# Altium schematic sheet Sensors.SchDoc: RespiraWorks
size A3; CompanyName: RespiraWorks; DrawnBy: E. Chiu; Organization: Altium; DocumentNumber: 7; Revision: A1; SheetNumber: 7; SheetTotal: 8; PageSetup: Record=PageOptions|CenterHorizontal=True|CenterVertical=True|PrintScale=0.67|XCorrection=1.00|YCorrection=1.00|PrintKind=0|BorderSize=5000000|LeftOffset=0|BottomOffset=0|Orientation=2|PaperLength=1000|PaperWidth=1000|Scale=100|PaperSource=276|PrintQuality=-3|MediaType=1|DitherType=10|PrintScaleMode=1|PaperKind=11"x17" 279.4x431.8mm|PaperIndex=3; ProjectName: FALCON 3S
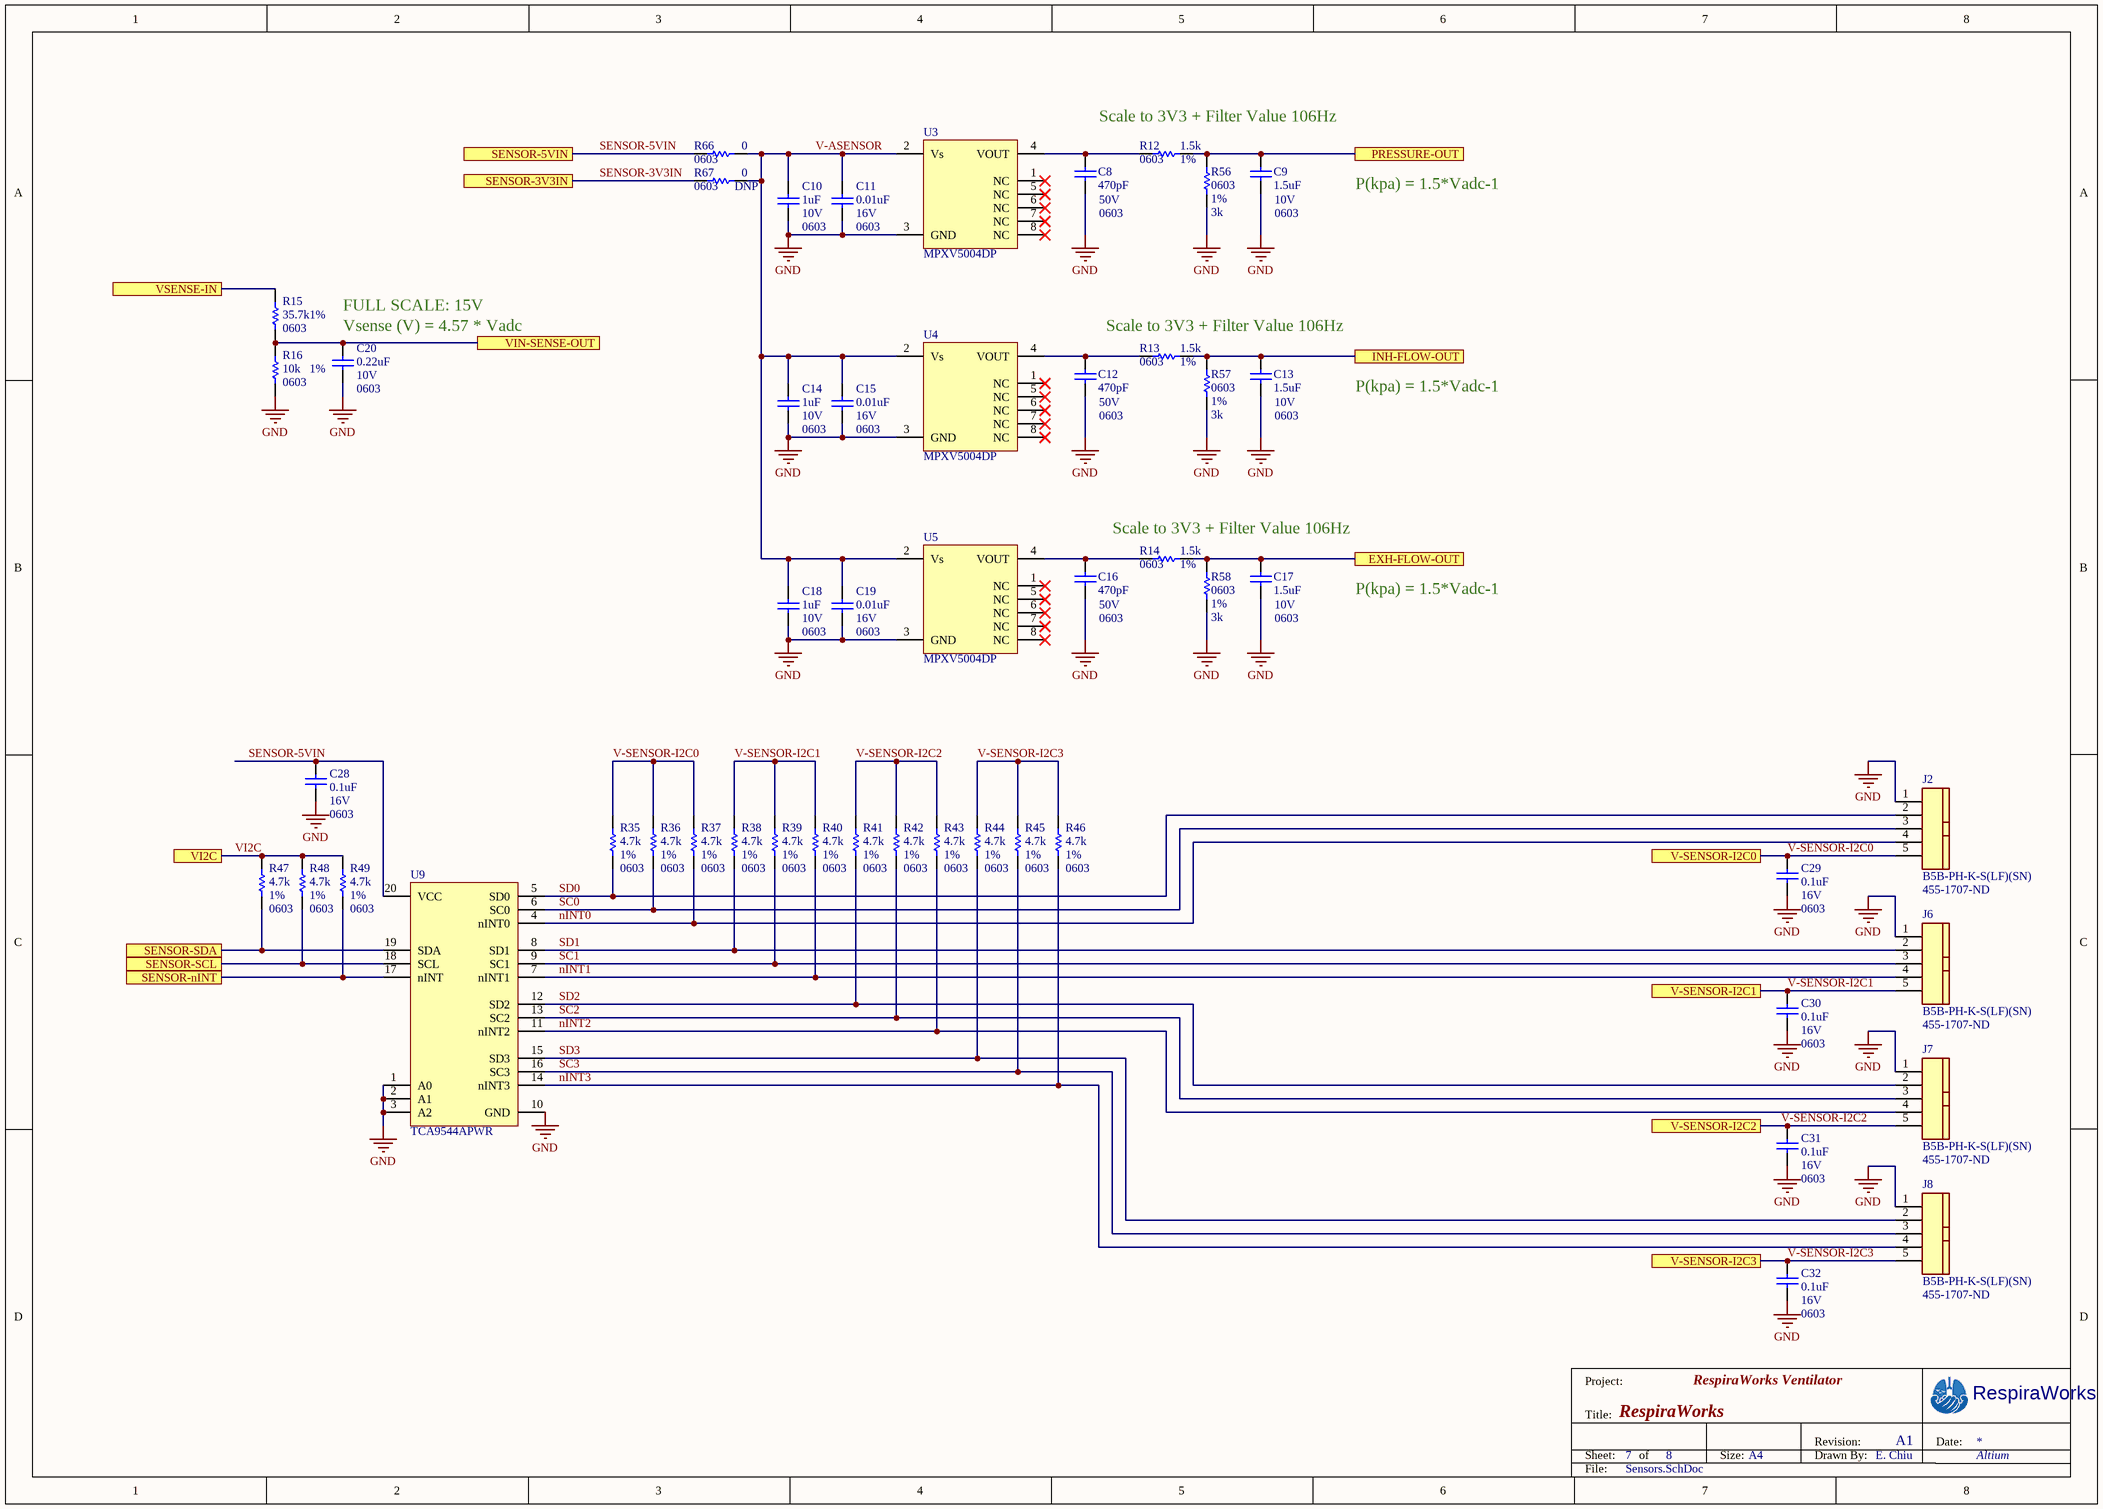
[diagram p0: Sensors.SchDoc]

## Parts
C8  value 470pF  Voltage: 50V  PCB Package: 0603  [CAP0603]  (hidden comment: CAP 0603)
C9  value 1.5uF  Voltage: 10V  PCB Package: 0603  [CAP0603]  (hidden comment: CAP 0603)
C10  value 1uF  Voltage: 10V  PCB Package: 0603  [CAP0603]  (hidden comment: CAP 0603)
C11  value 0.01uF  Voltage: 16V  PCB Package: 0603  [CAP0603]  (hidden comment: CAP 0603)
C12  value 470pF  Voltage: 50V  PCB Package: 0603  [CAP0603]  (hidden comment: CAP 0603)
C13  value 1.5uF  Voltage: 10V  PCB Package: 0603  [CAP0603]  (hidden comment: CAP 0603)
C14  value 1uF  Voltage: 10V  PCB Package: 0603  [CAP0603]  (hidden comment: CAP 0603)
C15  value 0.01uF  Voltage: 16V  PCB Package: 0603  [CAP0603]  (hidden comment: CAP 0603)
C16  value 470pF  Voltage: 50V  PCB Package: 0603  [CAP0603]  (hidden comment: CAP 0603)
C17  value 1.5uF  Voltage: 10V  PCB Package: 0603  [CAP0603]  (hidden comment: CAP 0603)
C18  value 1uF  Voltage: 10V  PCB Package: 0603  [CAP0603]  (hidden comment: CAP 0603)
C19  value 0.01uF  Voltage: 16V  PCB Package: 0603  [CAP0603]  (hidden comment: CAP 0603)
C20  value 0.22uF  Voltage: 10V  PCB Package: 0603  [CAP0603]  (hidden comment: CAP 0603)
C28  value 0.1uF  Voltage: 16V  PCB Package: 0603  [CAP0603]  (hidden comment: CAP 0603)
C29  value 0.1uF  Voltage: 16V  PCB Package: 0603  [CAP0603]  (hidden comment: CAP 0603)
C30  value 0.1uF  Voltage: 16V  PCB Package: 0603  [CAP0603]  (hidden comment: CAP 0603)
C31  value 0.1uF  Voltage: 16V  PCB Package: 0603  [CAP0603]  (hidden comment: CAP 0603)
C32  value 0.1uF  Voltage: 16V  PCB Package: 0603  [CAP0603]  (hidden comment: CAP 0603)
J2  B5B-PH-K-S(LF)(SN)  Supplier Part Number 1: 455-1707-ND  [JST_B5B-XH-AM]
J6  B5B-PH-K-S(LF)(SN)  Supplier Part Number 1: 455-1707-ND  [JST_B5B-XH-AM]
J7  B5B-PH-K-S(LF)(SN)  Supplier Part Number 1: 455-1707-ND  [JST_B5B-XH-AM]
J8  B5B-PH-K-S(LF)(SN)  Supplier Part Number 1: 455-1707-ND  [JST_B5B-XH-AM]
R12  value 1.5k  PCB Package: 0603  Tolerance: 1%  [RES0603]  (hidden comment: RES 0603)
R13  value 1.5k  PCB Package: 0603  Tolerance: 1%  [RES0603]  (hidden comment: RES 0603)
R14  value 1.5k  PCB Package: 0603  Tolerance: 1%  [RES0603]  (hidden comment: RES 0603)
R15  value 35.7k  PCB Package: 0603  Tolerance: 1%  [RES0603]  (hidden comment: RES 0603)
R16  value 10k  PCB Package: 0603  Tolerance: 1%  [RES0603]  (hidden comment: RES 0603)
R35  value 4.7k  PCB Package: 0603  Tolerance: 1%  [RES0603]  (hidden comment: RES 0603)
R36  value 4.7k  PCB Package: 0603  Tolerance: 1%  [RES0603]  (hidden comment: RES 0603)
R37  value 4.7k  PCB Package: 0603  Tolerance: 1%  [RES0603]  (hidden comment: RES 0603)
R38  value 4.7k  PCB Package: 0603  Tolerance: 1%  [RES0603]  (hidden comment: RES 0603)
R39  value 4.7k  PCB Package: 0603  Tolerance: 1%  [RES0603]  (hidden comment: RES 0603)
R40  value 4.7k  PCB Package: 0603  Tolerance: 1%  [RES0603]  (hidden comment: RES 0603)
R41  value 4.7k  PCB Package: 0603  Tolerance: 1%  [RES0603]  (hidden comment: RES 0603)
R42  value 4.7k  PCB Package: 0603  Tolerance: 1%  [RES0603]  (hidden comment: RES 0603)
R43  value 4.7k  PCB Package: 0603  Tolerance: 1%  [RES0603]  (hidden comment: RES 0603)
R44  value 4.7k  PCB Package: 0603  Tolerance: 1%  [RES0603]  (hidden comment: RES 0603)
R45  value 4.7k  PCB Package: 0603  Tolerance: 1%  [RES0603]  (hidden comment: RES 0603)
R46  value 4.7k  PCB Package: 0603  Tolerance: 1%  [RES0603]  (hidden comment: RES 0603)
R47  value 4.7k  PCB Package: 0603  Tolerance: 1%  [RES0603]  (hidden comment: RES 0603)
R48  value 4.7k  PCB Package: 0603  Tolerance: 1%  [RES0603]  (hidden comment: RES 0603)
R49  value 4.7k  PCB Package: 0603  Tolerance: 1%  [RES0603]  (hidden comment: RES 0603)
R56  value 3k  PCB Package: 0603  Tolerance: 1%  [RES0603]  (hidden comment: RES 0603)
R57  value 3k  PCB Package: 0603  Tolerance: 1%  [RES0603]  (hidden comment: RES 0603)
R58  value 3k  PCB Package: 0603  Tolerance: 1%  [RES0603]  (hidden comment: RES 0603)
R66  value 0  PCB Package: 0603  [RES0603]  (hidden comment: RES 0603)
R67  value 0  PCB Package: 0603  Do Not Populate: DNP  [RES0603]  (hidden comment: RES 0603)
U3  MPXV5004DP  [8-SOP-MPXV]
U4  MPXV5004DP  [8-SOP-MPXV]
U5  MPXV5004DP  [8-SOP-MPXV]
U9  TCA9544APWR  [20-pw]

## Ports
EXH-FLOW-OUT, INH-FLOW-OUT, PRESSURE-OUT, SENSOR-3V3IN, SENSOR-5VIN, SENSOR-nINT, SENSOR-SCL, SENSOR-SDA, V-SENSOR-I2C0, V-SENSOR-I2C1, V-SENSOR-I2C2, V-SENSOR-I2C3, VI2C, VIN-SENSE-OUT, VSENSE-IN

## Nets
GND: C8.1 C9.1 C10.2 C11.2 C12.1 C13.1 C14.2 C15.2 C16.1 C17.1 C18.2 C19.2 C20.1 C28.2 C29.2 C30.2 C31.2 C32.2 J2.1 J6.1 J7.1 J8.1 R16.1 R56.1 R57.1 R58.1 U3.3(GND) U4.3(GND) U5.3(GND) U9.1(A0) U9.2(A1) U9.3(A2) U9.10(GND)
EXH-FLOW-OUT: C17.2 R14.2 R58.2 ; port EXH-FLOW-OUT
INH-FLOW-OUT: C13.2 R13.2 R57.2 ; port INH-FLOW-OUT
nINT0: J2.4 R37.1 U9.4(nINT0)
nINT1: J6.4 R40.1 U9.7(nINT1)
nINT2: J7.4 R43.1 U9.11(nINT2)
nINT3: J8.4 R46.1 U9.14(nINT3)
PRESSURE-OUT: C9.2 R12.2 R56.2 ; port PRESSURE-OUT
SC0: J2.3 R36.1 U9.6(SC0)
SC1: J6.3 R39.1 U9.9(SC1)
SC2: J7.3 R42.1 U9.13(SC2)
SC3: J8.3 R45.1 U9.16(SC3)
SD0: J2.2 R35.1 U9.5(SD0)
SD1: J6.2 R38.1 U9.8(SD1)
SD2: J7.2 R41.1 U9.12(SD2)
SD3: J8.2 R44.1 U9.15(SD3)
SENSOR-3V3IN: R67.1 ; port SENSOR-3V3IN
SENSOR-5VIN: C28.1 R66.1 U9.20(VCC) ; port SENSOR-5VIN
SENSOR-nINT: R49.1 U9.17(nINT) ; port SENSOR-nINT
SENSOR-SCL: R48.1 U9.18(SCL) ; port SENSOR-SCL
SENSOR-SDA: R47.1 U9.19(SDA) ; port SENSOR-SDA
V-ASENSOR: C10.1 C11.1 C14.1 C15.1 C18.1 C19.1 R66.2 R67.2 U3.2(Vs) U4.2(Vs) U5.2(Vs)
V-SENSOR-I2C0: C29.1 J2.5 R35.2 R36.2 R37.2 ; port V-SENSOR-I2C0
V-SENSOR-I2C1: C30.1 J6.5 R38.2 R39.2 R40.2 ; port V-SENSOR-I2C1
V-SENSOR-I2C2: C31.1 J7.5 R41.2 R42.2 R43.2 ; port V-SENSOR-I2C2
V-SENSOR-I2C3: C32.1 J8.5 R44.2 R45.2 R46.2 ; port V-SENSOR-I2C3
VI2C: R47.2 R48.2 R49.2 ; port VI2C
VIN-SENSE-OUT: C20.2 R15.1 R16.2 ; port VIN-SENSE-OUT
VSENSE-IN: R15.2 ; port VSENSE-IN
NetC8_2: C8.2 R12.1 U3.4(VOUT)
NetC12_2: C12.2 R13.1 U4.4(VOUT)
NetC16_2: C16.2 R14.1 U5.4(VOUT)

Not connected (* = marked no-connect by the designer): U3 1(NC)* 5(NC)* 6(NC)* 7(NC)* 8(NC)*; U4 1(NC)* 5(NC)* 6(NC)* 7(NC)* 8(NC)*; U5 1(NC)* 5(NC)* 6(NC)* 7(NC)* 8(NC)*

## Notes on the sheet
- Scale to 3V3 + Filter Value 106Hz
- P(kpa) = 1.5*Vadc-1
- (near C20) FULL SCALE: 15V
- (near C20) Vsense (V) = 4.57 * Vadc
- Project:
- RespiraWorks Ventilator
- Title:
- Sheet:
- of
- Size:
- A4
- Drawn By:
- Revision:
- Date:
- File:

## Library data of the parts
C8 C12 C16 = CAP 0603: Manufacturer P/N: CC0603MRX7R9BB471; Manufacturer: Yageo; Type: X7R; Do Not Populate: *
C9 C13 C17 = CAP 0603: Manufacturer P/N: C1608X7R1A155K080AC; Manufacturer: TDK; Type: X7R; Do Not Populate: *
C10 C14 C18 = CAP 0603: Manufacturer P/N: CC0603KRX7R6BB105; Manufacturer: Yageo; Type: X7R; Do Not Populate: *
C11 C15 C19 = CAP 0603: Manufacturer P/N: CL10B103KO8NNNC; Manufacturer: Samsung; Type: X7R; Do Not Populate: *
C20 = CAP 0603: Manufacturer P/N: CAP CER 0.22UF 10V X7R 0603; Manufacturer: Yageo; Type: X7R; Do Not Populate: *
C28-C32 = CAP 0603: Manufacturer P/N: CC0603KRX7R7BB104; Manufacturer: Yageo; Type: X7R; Do Not Populate: *
J2 J6-J8 = B5B-PH-K-S(LF)(SN): CONN HEADER PH TOP 5POS 2MM; Manufacturer: JST Sales America Inc.; Connector Type: Header, Shrouded; Number of Positions: 5; Number of Positions Loaded: All; Pitch: 0.079" (2.00mm); Supplier 1: Digi-Key; Manufacturer Part Number: B5B-PH-K-S(LF)(SN); RoHS: RoHS Compliant; Category: Connectors, Interconnects; Stock 1: 20730; Pricing 1: 1=0.29, 10=0.274, 100=0.1918, 500=0.16438, 1000=0.13699, 5000=0.11742, 10000=0.10959 (USD); Packaging: Bulk; Part Status: Active; Contact Type: Male Pin; Number of Rows: 1; Row Spacing: -; Contact Mating Length: 0.130" (3.30mm); Mounting Type: Through Hole; Termination: Press-Fit, Solder; Fastening Type: Detent Lock; Features: -; Contact Finish: Tin; Contact Finish Thickness: -; Color: Natural; ComponentLink1URL: http://www.jst-mfg.com/product/pdf/eng/ePH.pdf; ComponentLink1Description: http://www.jst-mfg.com/product/pdf/eng/ePH.pdf; Manufacturer P/N: B5B-PH-K-S(LF)(SN)
R12-R14 = RES 0603: Manufacturer P/N: RC0603FR-071K5L; Manufacturer: Yageo; Do Not Populate: *
R15 = RES 0603: Manufacturer P/N: RC0603FR-0735K7L; Manufacturer: Yageo; Do Not Populate: *
R16 = RES 0603: Manufacturer P/N: RC0603FR-0710KL; Manufacturer: Yageo; Do Not Populate: *
R35-R49 = RES 0603: Manufacturer P/N: RC0603FR-074K7L; Manufacturer: Yageo; Do Not Populate: *
R56-R58 = RES 0603: Manufacturer P/N: RC0603FR-073KL; Manufacturer: Yageo; Do Not Populate: *
R66 R67 = RES 0603: Manufacturer P/N: RC0603JR-070RL; Manufacturer: Yageo; Tolerance: 5%
  R66: Do Not Populate: *
U3-U5 = MPXV5004DP: Pressure Sensor 0.57PSI (3.92kPa) Differential Male - 0.13" (3.3mm) Tube, Dual 1 V ~ 4.9 V 8-BSOP (0.475", 12.06mm Width) Dual Ports, Same Side; Manufacturer: NXP; Do Not Populate: *; PCB Package: 8-SOP-MPXV; Manufacturer P/N: MPXV5004DP
U9 = TCA9544APWR: IC I2C SW 4CH W/RESET 20TSSOP; Manufacturer: Texas Instruments; PCB Package: 20-TSSOP; Do Not Populate: *; Manufacturer P/N: TCA9544APWR